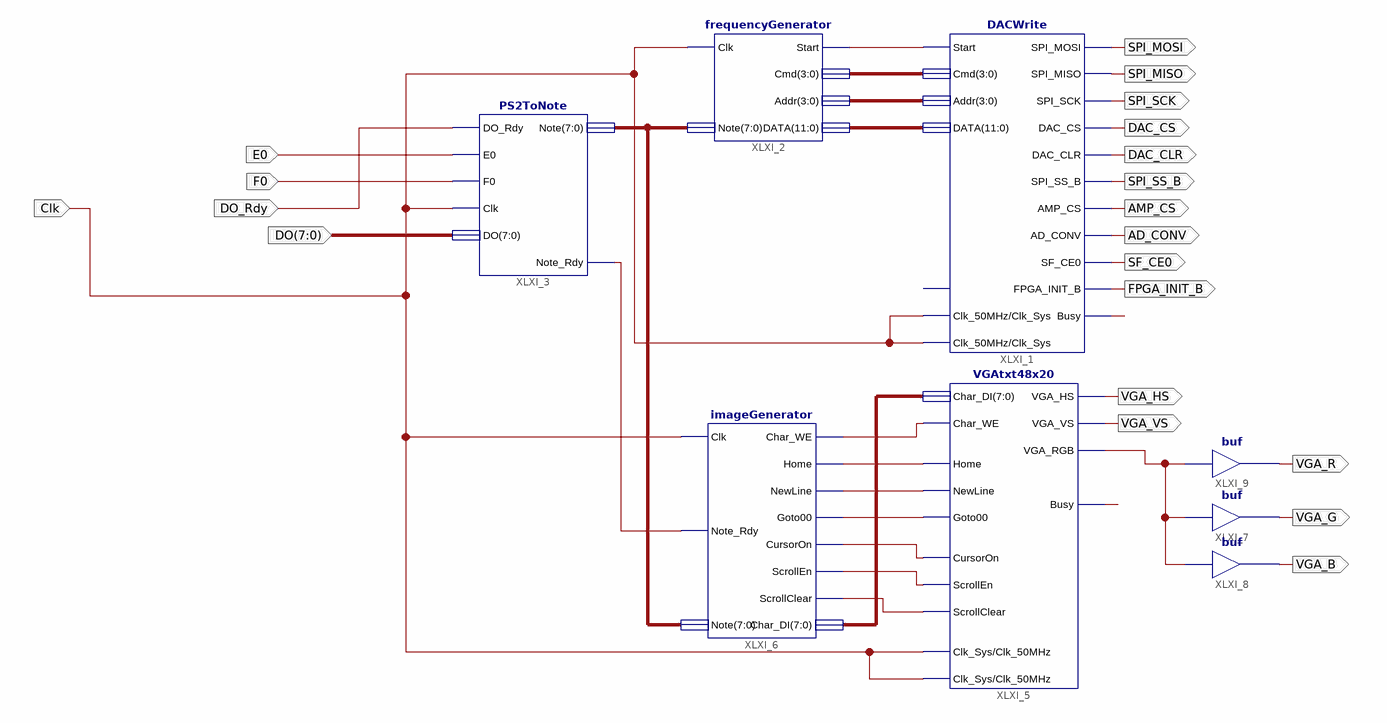
[diagram p0: schematic sheet 1]
// Xilinx ISE schematic MainTest.sch (spartan3e) as structural Verilog: 8 symbols, 20 ports
module MainTest (
  input  Clk,
  input  DO_Rdy,
  input  [7:0] DO,
  input  F0,
  input  E0,
  output SPI_MOSI,
  output SPI_MISO,
  output SPI_SCK,
  output DAC_CS,
  output DAC_CLR,
  output SPI_SS_B,
  output AMP_CS,
  output AD_CONV,
  output SF_CE0,
  output FPGA_INIT_B,
  output VGA_HS,
  output VGA_VS,
  output VGA_R,
  output VGA_G,
  output VGA_B
);

  wire Busy, XLXN_1, XLXN_15, XLXN_49, XLXN_51, XLXN_53, XLXN_54, XLXN_55, XLXN_56, XLXN_57, XLXN_67, XLXN_72;
  wire [3:0] XLXN_2, XLXN_3;
  wire [7:0] XLXN_47, XLXN_52;
  wire [11:0] XLXN_4;

  DACWrite XLXI_1 (
    .Start(XLXN_1), .SPI_MISO(SPI_MISO), .Cmd(XLXN_2), .Addr(XLXN_3), .DATA(XLXN_4), .DAC_CLR(DAC_CLR),
    .DAC_CS(DAC_CS), .SPI_MOSI(SPI_MOSI), .SPI_SCK(SPI_SCK), .SPI_SS_B(SPI_SS_B), .AMP_CS(AMP_CS),
    .AD_CONV(AD_CONV), .SF_CE0(SF_CE0), .FPGA_INIT_B(FPGA_INIT_B), .Busy(XLXN_15), .Clk_50MHz(Clk),
    .Clk_Sys(Clk));  // open: Reset
  frequencyGenerator XLXI_2 (.Clk(Clk), .Note(XLXN_47), .Start(XLXN_1), .Cmd(XLXN_2), .Addr(XLXN_3), .DATA(XLXN_4));
  PS2ToNote XLXI_3 (.DO_Rdy(DO_Rdy), .E0(E0), .F0(F0), .Clk(Clk), .DO(DO), .Note_Rdy(XLXN_49), .Note(XLXN_47));
  VGAtxt48x20 XLXI_5 (
    .Char_DI(XLXN_52), .Home(XLXN_53), .NewLine(XLXN_54), .Goto00(XLXN_55), .Clk_Sys(Clk), .Clk_50MHz(Clk),
    .CursorOn(XLXN_56), .ScrollEn(XLXN_57), .ScrollClear(XLXN_67), .Busy(Busy), .VGA_HS(VGA_HS),
    .VGA_VS(VGA_VS), .VGA_RGB(XLXN_72), .Char_WE(XLXN_51));
  imageGenerator XLXI_6 (
    .Clk(Clk), .Note_Rdy(XLXN_49), .Note(XLXN_47), .Char_WE(XLXN_51), .Home(XLXN_53), .NewLine(XLXN_54),
    .Goto00(XLXN_55), .CursorOn(XLXN_56), .ScrollEn(XLXN_57), .ScrollClear(XLXN_67), .Char_DI(XLXN_52));
  buf XLXI_7 (VGA_G, XLXN_72);
  buf XLXI_8 (VGA_B, XLXN_72);
  buf XLXI_9 (VGA_R, XLXN_72);
endmodule
